# Altium schematic sheet Test Points.SchDoc
size 297 x 209 mm; SheetNumber: 9; SheetTotal: 29
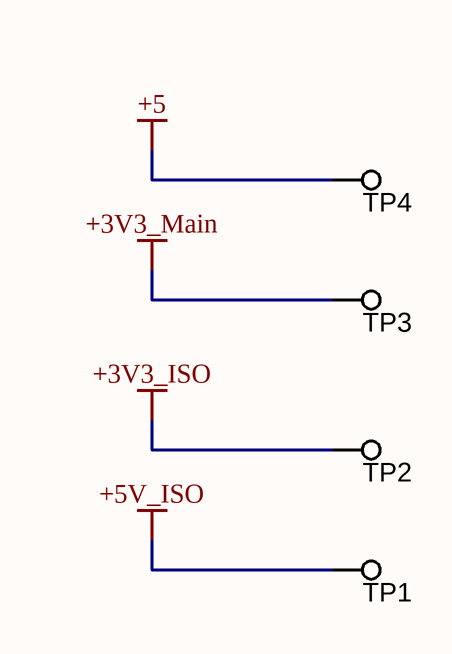
[diagram p0: Test Points.SchDoc]

## Parts
TP1  TESTPOINT_PROBE  [TP80D50]  (value not drawn)  (no BOM)
TP2  TESTPOINT_PROBE  [TP80D50]  (value not drawn)  (no BOM)
TP3  TESTPOINT_PROBE  [TP80D50]  (value not drawn)  (no BOM)
TP4  TESTPOINT_PROBE  [TP80D50]  (value not drawn)  (no BOM)

## Nets
+3V3_ISO: TP2.1
+3V3_Main: TP3.1
+5: TP4.1
+5V_ISO: TP1.1

## Notes on the sheet
- Drawn
- Name
- Date
- Drawing Title
- Checked
- Drawing No.
- Approved
- Size
- A4
- Ver.
- Rev.
- Sheet
- Of

## Library data of the parts
TP1-TP4 = TESTPOINT_PROBE: TEST POINT; MANF: MANF; MANF_P#: MANF_P#; VALUE: VALUE